# EAGLE board ArmazCape - Rev B4 (EAGLE 7.7.0)
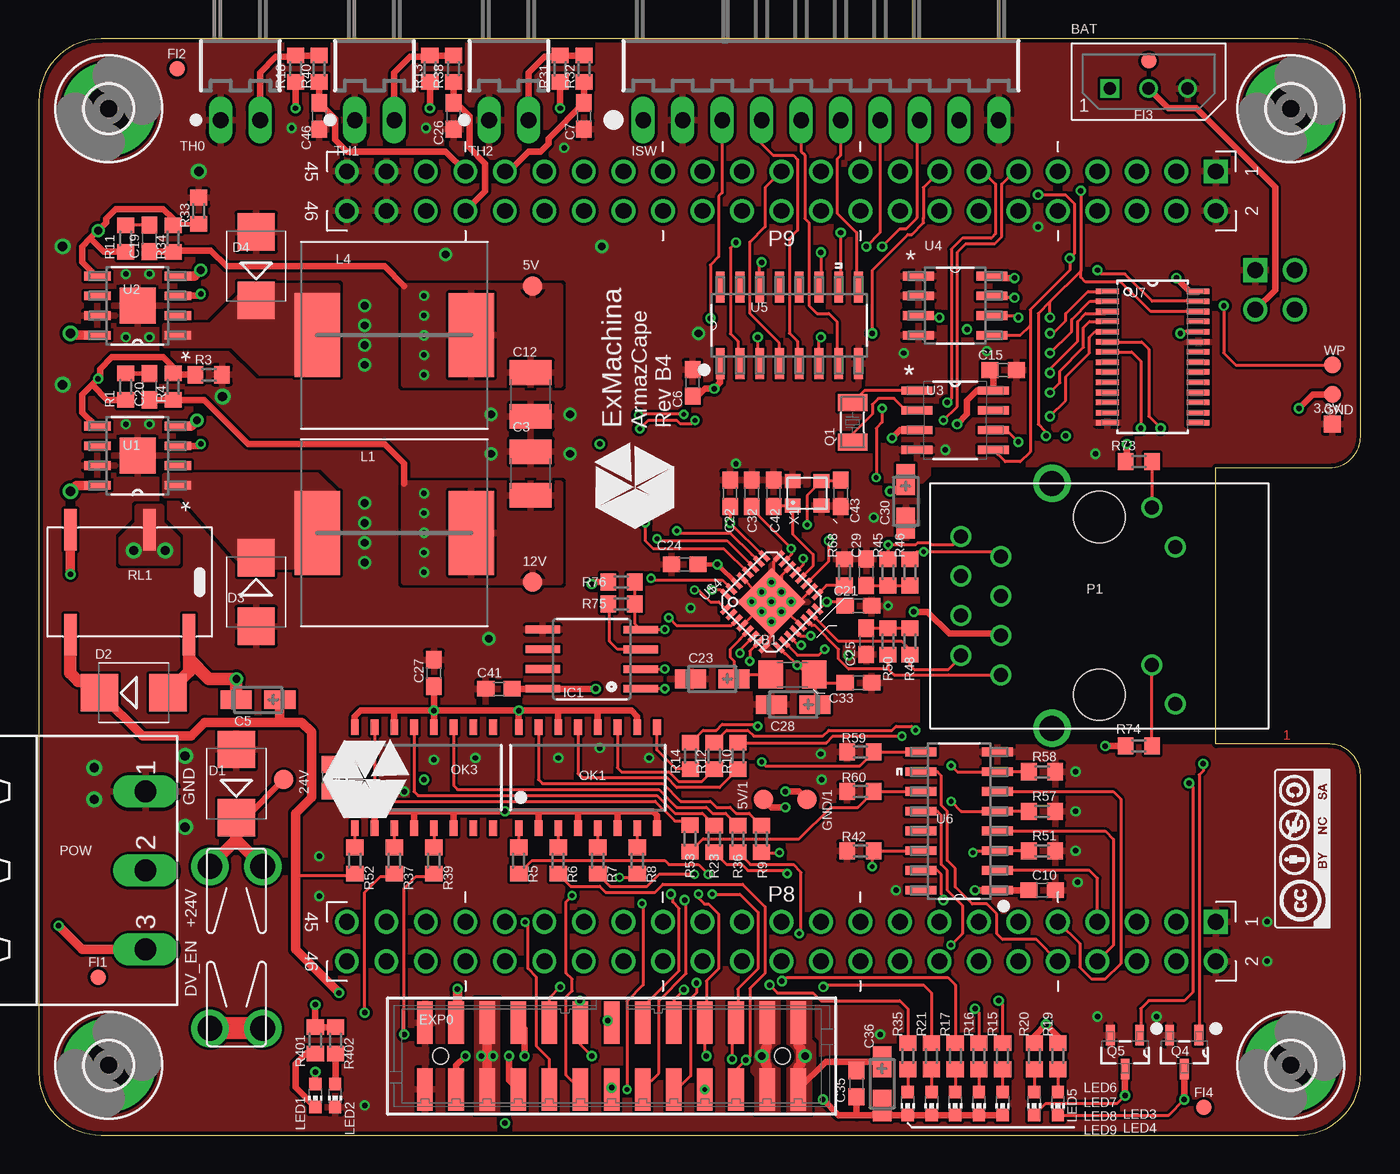
[diagram p4: board, top side]
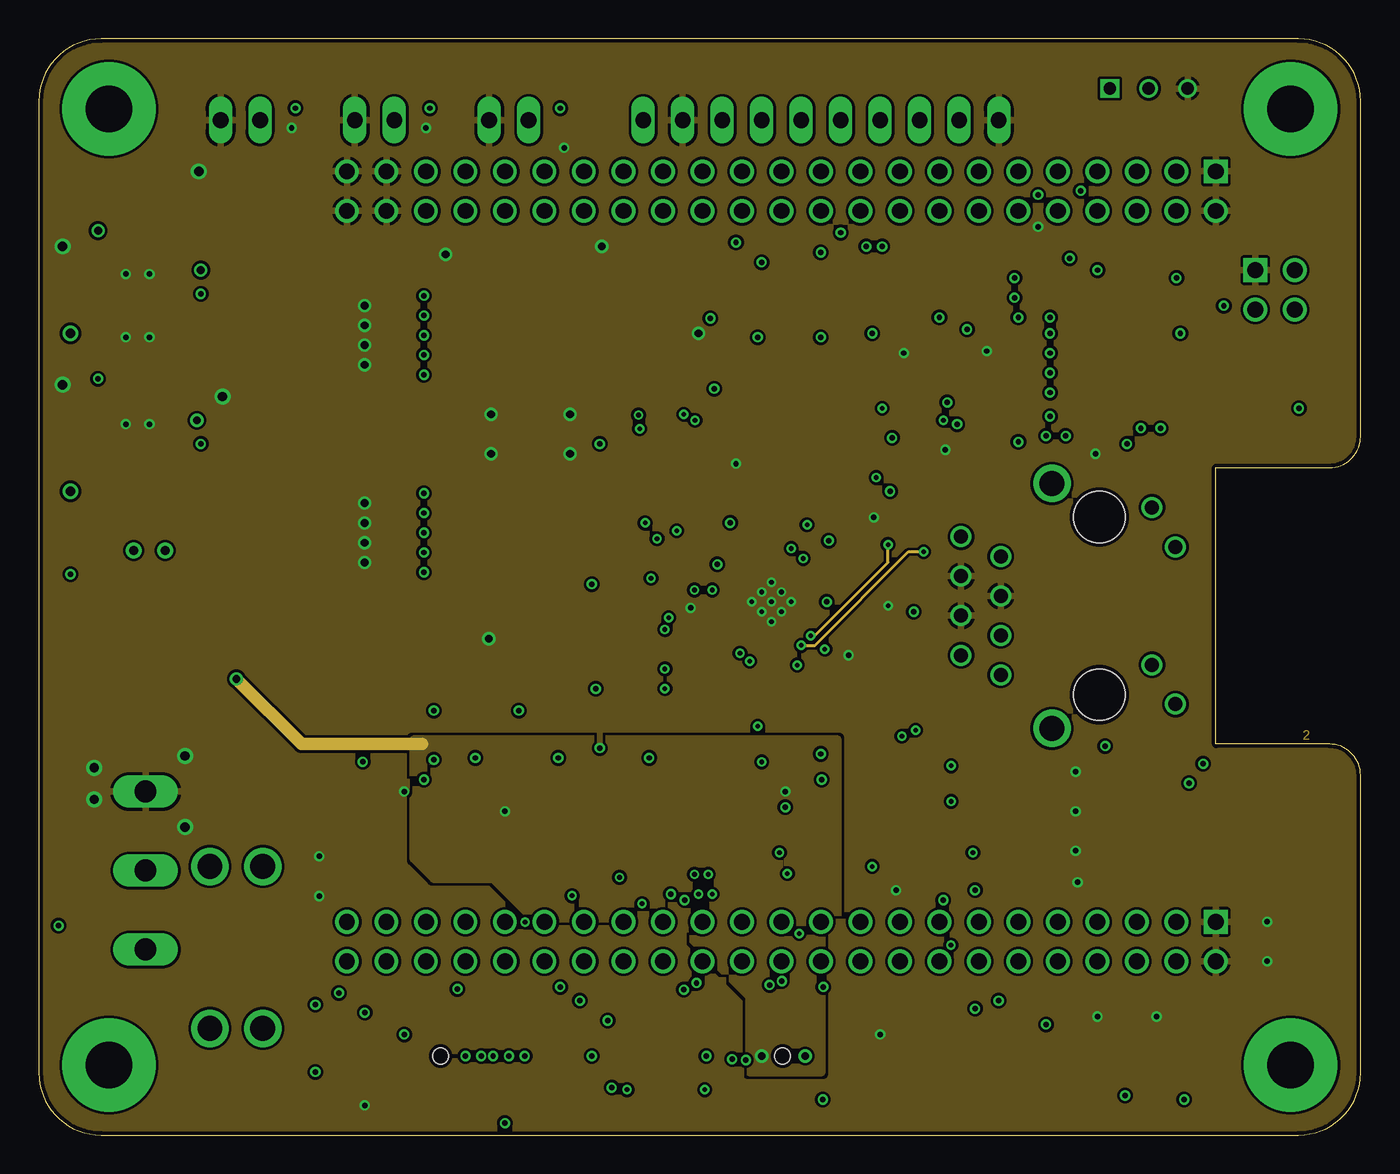
[diagram p5: board, inner layer Route2]
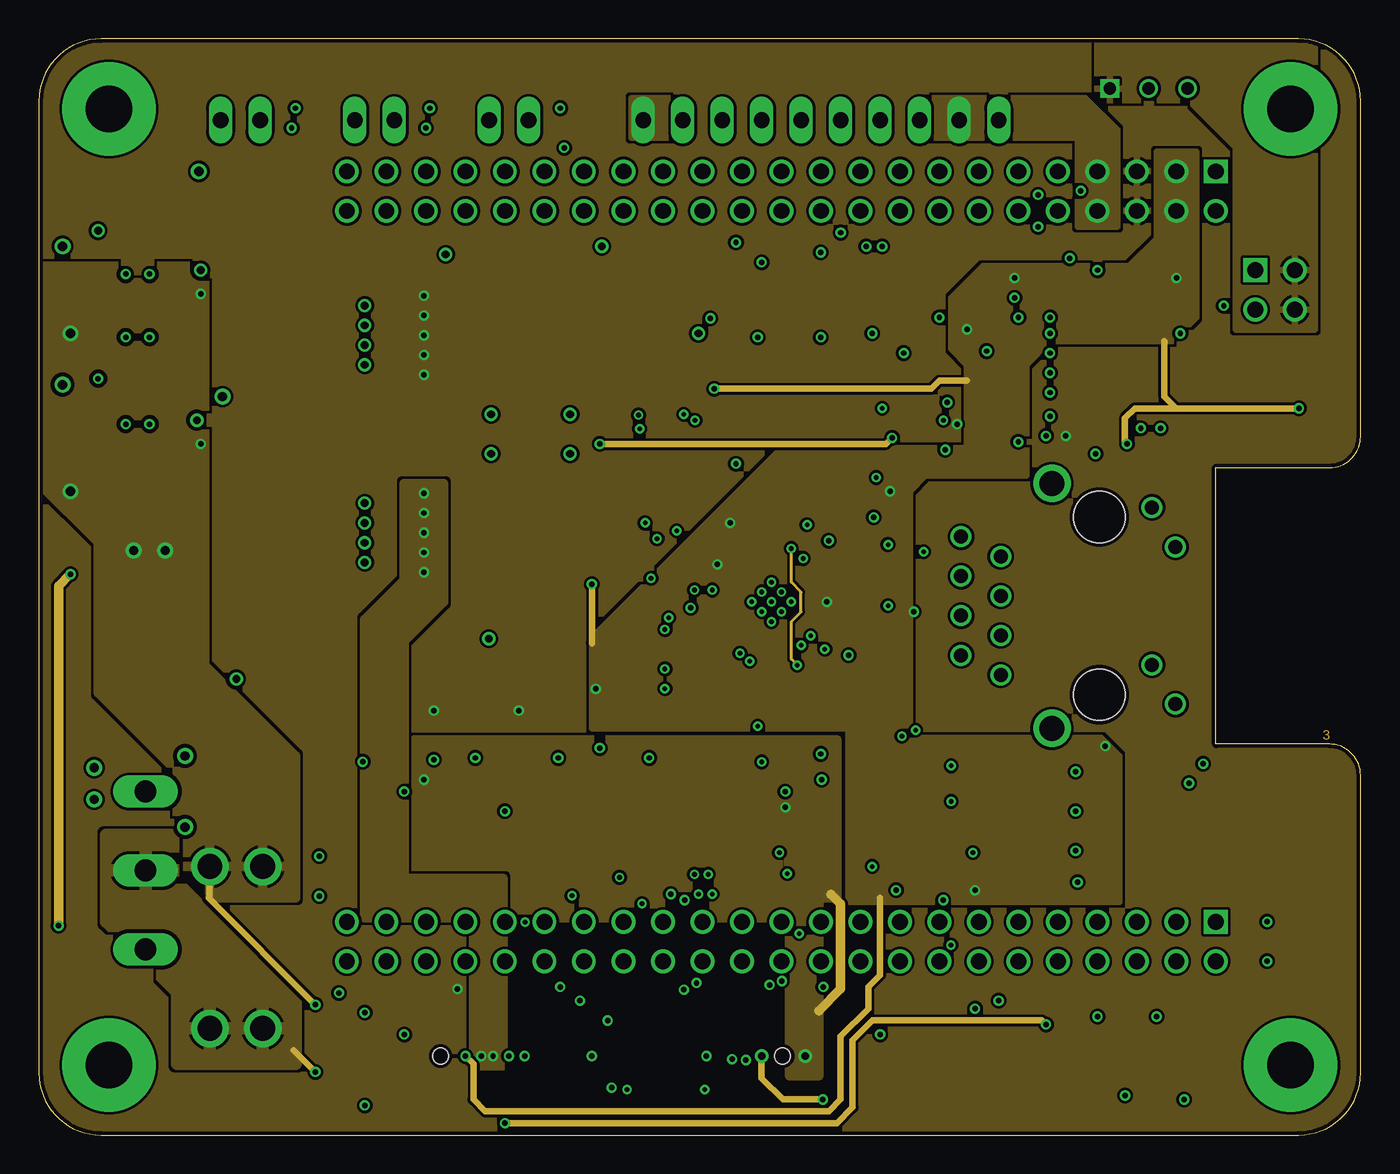
[diagram p6: board, inner layer Route15]
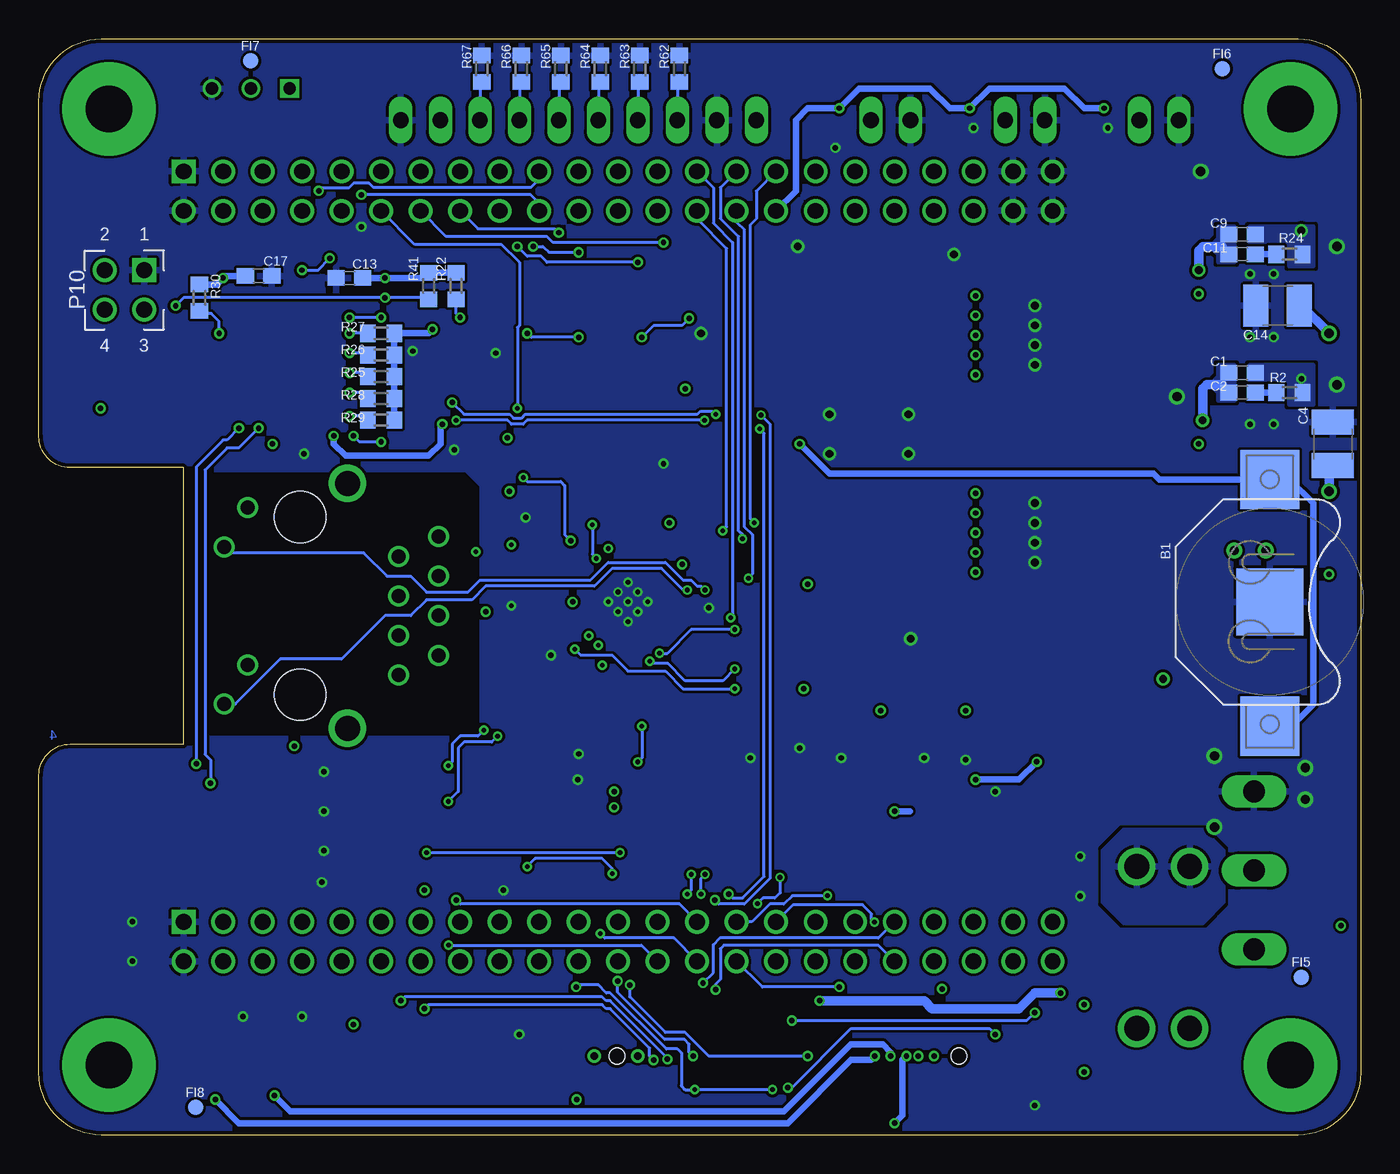
[diagram p7: board, bottom side, seen from below]

Size 85 x 70.5 mm. Coordinates in mm from the lower left corner, seen from the top.
Outline: 75.69,42.93 83,42.93 arc90 85,44.93 85,66.5 arc90 81,70.5 4,70.5 arc90 0,66.5 0,4 arc90 4,0 81,0 arc90 85,4 85,23.15 arc90 83,25.15 75.69,25.15 75.69,42.93
Copper layers (1+2*15+16): Top 0.018mm / dielectric 0.36mm / Route2 0.035mm / dielectric 0.71mm / Route15 0.035mm / dielectric 0.36mm / Bottom 0.018mm
Design rules "eC_4Layer_PClass5_BaseCopperO18-I35 *": minimum track width 0.175mm, minimum drill 0.3mm, track to track 0.175mm, track to pad 0.175mm, pad to pad 0.175mm, via to via 0.175mm, smd to smd 0mil, copper to edge 0.25mm, drill to drill 0.35mm, minimum pad ring 0.2mm, minimum via ring 0.15mm, stop-mask expansion 0mil, vias tented up to drill 0.45mm, thermal gap 0.2mm
Net classes: 0 default: width 0.178 mm, drill 0.25 mm, clearance 0.102 mm; 1 supply: width 0.406 mm, drill 0.35 mm, clearance 0.203 mm to class 0, clearance 0.02 mm

## Footprints (pad centres in the part's own frame; a part is rotated, then mirrored left to right if it is on the bottom)
TP11R = smd 1.1 x 1.1: TP 0,0
B1,27 = smd 1.27 x 1.27: TP 0,0
3000 = smd 3.81 x 3.81: +1 -7.874,0; +2 8.001,0 | smd 4.318 x 4.318: - 0,0
5267-03A = drill 0.8 square: P1 -2.5,0 | drill 0.8: P2 0,0; P3 2.5,0
BBB = drill 1.016 square: P8.1 -27.94,46.99; P9.1 -27.94,-1.27; P10.1 -30.48,5.08 | drill 1.016: P8.2 -27.94,49.53; P8.3 -25.4,46.99; P8.4 -25.4,49.53; P8.5 -22.86,46.99; P8.6 -22.86,49.53; P8.7 -20.32,46.99; P8.8 -20.32,49.53; P8.9 -17.78,46.99; P8.10 -17.78,49.53; P8.11 -15.24,46.99; P8.12 -15.24,49.53; P8.13 -12.7,46.99; P8.14 -12.7,49.53; P8.15 -10.16,46.99; P8.16 -10.16,49.53; P8.17 -7.62,46.99; P8.18 -7.62,49.53; P8.19 -5.08,46.99; P8.20 -5.08,49.53; P8.21 -2.54,46.99; P8.22 -2.54,49.53; P8.23 0,46.99; P8.24 0,49.53; P8.25 2.54,46.99; P8.26 2.54,49.53; P8.27 5.08,46.99; P8.28 5.08,49.53; P8.29 7.62,46.99; P8.30 7.62,49.53; P8.31 10.16,46.99; P8.32 10.16,49.53; P8.33 12.7,46.99; P8.34 12.7,49.53; P8.35 15.24,46.99; P8.36 15.24,49.53; P8.37 17.78,46.99; P8.38 17.78,49.53; P8.39 20.32,46.99; P8.40 20.32,49.53; P8.41 22.86,46.99; P8.42 22.86,49.53; P8.43 25.4,46.99; P8.44 25.4,49.53; P8.45 27.94,46.99; P8.46 27.94,49.53; P9.2 -27.94,1.27; P9.3 -25.4,-1.27; P9.4 -25.4,1.27; P9.5 -22.86,-1.27; P9.6 -22.86,1.27; P9.7 -20.32,-1.27; P9.8 -20.32,1.27; P9.9 -17.78,-1.27; P9.10 -17.78,1.27; P9.11 -15.24,-1.27; P9.12 -15.24,1.27; P9.13 -12.7,-1.27; P9.14 -12.7,1.27; P9.15 -10.16,-1.27; P9.16 -10.16,1.27; P9.17 -7.62,-1.27; P9.18 -7.62,1.27; P9.19 -5.08,-1.27; P9.20 -5.08,1.27; P9.21 -2.54,-1.27; P9.22 -2.54,1.27; P9.23 0,-1.27; P9.24 0,1.27; P9.25 2.54,-1.27; P9.26 2.54,1.27; P9.27 5.08,-1.27; P9.28 5.08,1.27; P9.29 7.62,-1.27; P9.30 7.62,1.27; P9.31 10.16,-1.27; P9.32 10.16,1.27; P9.33 12.7,-1.27; P9.34 12.7,1.27; P9.35 15.24,-1.27; P9.36 15.24,1.27; P9.37 17.78,-1.27; P9.38 17.78,1.27; P9.39 20.32,-1.27; P9.40 20.32,1.27; P9.41 22.86,-1.27; P9.42 22.86,1.27; P9.43 25.4,-1.27; P9.44 25.4,1.27; P9.45 27.94,-1.27; P9.46 27.94,1.27; P10.2 -33.02,5.08; P10.3 -30.48,7.62; P10.4 -33.02,7.62
C0603 = smd 1.1 x 1: 1 -0.85,0; 2 0.85,0
C1210 = smd 1.6 x 2.7: 1 -1.4,0; 2 1.4,0
CT3216 = smd 2 x 1.2: + -1.4,0; - 1.4,0
SMB = smd 2.4 x 2.4: A 2.2,0; C -2.2,0
87832-26 = smd 1 x 2.75: 1 -12,-2.15; 2 -12,2.15; 3 -10,-2.15; 4 -10,2.15; 5 -8,-2.15; 6 -8,2.15; 7 -6,-2.15; 8 -6,2.15; 9 -4,-2.15; 10 -4,2.15; 11 -2,-2.15; 12 -2,2.15; 13 0,-2.15; 14 0,2.15; 15 2,-2.15; 16 2,2.15; 17 4,-2.15; 18 4,2.15; 19 6,-2.15; 20 6,2.15; 21 8,-2.15; 22 8,2.15; 23 10,-2.15; 24 10,2.15; 25 12,-2.15; 26 12,2.15 | hole 1: -11,0; 11,0
1206 = smd 1.6 x 1.8: 1 -1.451,0.025; 2 1.349,0.025
FIDUCIAL-1X2 = smd 1 x 1: 1 0,0
3557-LITTLE = drill 1.6: 1 -5.207,-1.702; 2 -5.207,1.702; 3 5.207,-1.702; 4 5.207,1.702
TP11SQ = smd 1.1 x 1.1: TP 0,0
P3,0 = drill 3 pad 6: 1 0,0
SOIC8 = smd 0.5 x 2.2: 1 -1.905,-3.154; 2 -0.645,-3.154; 3 0.625,-3.154; 4 1.895,-3.154; 5 1.905,3.154; 6 0.635,3.154; 7 -0.635,3.154; 8 -1.905,3.154
7395-10 = drill 1.016 long: 1 11.43,0; 2 8.89,0; 3 6.35,0; 4 3.81,0; 5 1.27,0; 6 -1.27,0; 7 -3.81,0; 8 -6.35,0; 9 -8.89,0; 10 -11.43,0
WE-PD_1260/1245/1280/1210 = smd 2.9 x 5.4: 1 -4.95,0; 2 4.95,0
CHIP-LED0603 = smd 0.8 x 0.8: A 0,-0.75; C 0,0.75
MINI-FLAT-16 = smd 1 x 0.5: 1 -3.24,4.445; 2 -3.24,3.175; 3 -3.24,1.905; 4 -3.24,0.635; 5 -3.24,-0.635; 6 -3.24,-1.905; 7 -3.24,-3.175; 8 -3.24,-4.445; 9 3.24,-4.445; 10 3.24,-3.175; 11 3.24,-1.905; 12 3.24,-0.635; 13 3.24,0.635; 14 3.24,1.905; 15 3.24,3.175; 16 3.24,4.445
WIZNET_RB1-125BAG1A = drill 0.9: L1 6.325,-3.38; L2 3.784,-4.899; L3 -3.786,-3.379; L4 -6.325,-4.9 | drill 0.9 pad 1.3: R1 -4.446,6.349; R2 -3.176,8.889; R3 -1.906,6.349; R4 -0.636,8.889; R5 0.634,6.349; R6 1.904,8.889; R7 3.174,6.349; R8 4.444,8.889 | drill 1.6 pad 2.184: S1 -7.876,3.049; S2 7.874,3.049 | hole 3.3: 5.714,-0.001; -5.716,-0.001
MSTBA3 = drill 1.397 long: 1 -5.08,5.08; 2 0,5.08; 3 5.08,5.08
ABS07 = smd 1.092 x 1.905: 1 -1.27,0; 2 1.27,0
SOT95P240X112-3N = smd 1.321 x 0.559: 1 -1.092,0.94; 2 -1.092,-0.94; 3 1.092,0
R0603 = smd 1 x 1.1: 1 -0.85,0; 2 0.85,0
G6L-1F = smd 0.8 x 2.66: 2 -1.27,-3.37; 4 3.81,-3.37; 5 3.81,3.37; 8 -3.81,3.37
7395-02 = drill 1.016 long: 1 1.27,0; 2 -1.27,0
SOIC127P600X170-9N = smd 1.702 x 0.559: 1 -2.591,1.905; 2 -2.591,0.635; 3 -2.591,-0.635; 4 -2.591,-1.905; 5 2.591,-1.905; 6 2.591,-0.635; 7 2.591,0.635; 8 2.591,1.905 | smd 2.311 x 2.311: 9 0,0
MAXIM_SOIC127P600X175-8N = smd 1.981 x 0.533: 1 -2.464,1.905; 2 -2.464,0.635; 3 -2.464,-0.635; 4 -2.464,-1.905; 5 2.464,-1.905; 6 2.464,-0.635; 7 2.464,0.635; 8 2.464,1.905
MICROCHIP_BY_ELEMENT14_BATCH_1_SOIC127P600X175-8N = smd 1.981 x 0.559: 1 -2.362,1.905; 2 -2.362,0.635; 3 -2.362,-0.635; 4 -2.362,-1.905; 5 2.362,-1.905; 6 2.362,-0.635; 7 2.362,0.635; 8 2.362,1.905
SOIC127P600X175-16N = smd 1.981 x 0.559: 1 -2.464,4.445; 2 -2.464,3.175; 3 -2.464,1.905; 4 -2.464,0.635; 5 -2.464,-0.635; 6 -2.464,-1.905; 7 -2.464,-3.175; 8 -2.464,-4.445; 9 2.464,-4.445; 10 2.464,-3.175; 11 2.464,-1.905; 12 2.464,-0.635; 13 2.464,0.635; 14 2.464,1.905; 15 2.464,3.175; 16 2.464,4.445
SOP65P640X110-28N = smd 1.473 x 0.356: 1 -2.921,4.216; 2 -2.921,3.581; 3 -2.921,2.921; 4 -2.921,2.286; 5 -2.921,1.626; 6 -2.921,0.965; 7 -2.921,0.33; 8 -2.921,-0.33; 9 -2.921,-0.965; 10 -2.921,-1.626; 11 -2.921,-2.286; 12 -2.921,-2.921; 13 -2.921,-3.581; 14 -2.921,-4.216; 15 2.921,-4.216; 16 2.921,-3.581; 17 2.921,-2.921; 18 2.921,-2.286; 19 2.921,-1.626; 20 2.921,-0.965; 21 2.921,-0.33; 22 2.921,0.33; 23 2.921,0.965; 24 2.921,1.626; 25 2.921,2.286; 26 2.921,2.921; 27 2.921,3.581; 28 2.921,4.216
QFN50P500X500X85-32L = smd 0.8 x 0.3: 1 -2.41,1.75; 2 -2.41,1.25; 3 -2.41,0.75; 4 -2.41,0.25; 5 -2.41,-0.25; 6 -2.41,-0.75; 7 -2.41,-1.25; 8 -2.41,-1.75; 17 2.41,-1.75; 18 2.41,-1.25; 19 2.41,-0.75; 20 2.41,-0.25; 21 2.41,0.25; 22 2.41,0.75; 23 2.41,1.25; 24 2.41,1.75 | smd 0.3 x 0.8: 9 -1.75,-2.41; 10 -1.25,-2.41; 11 -0.75,-2.41; 12 -0.25,-2.41; 13 0.25,-2.41; 14 0.75,-2.41; 15 1.25,-2.41; 16 1.75,-2.41; 25 1.75,2.41; 26 1.25,2.41; 27 0.75,2.41; 28 0.25,2.41; 29 -0.25,2.41; 30 -0.75,2.41; 31 -1.25,2.41; 32 -1.75,2.41 | smd 3.1 x 3.1: BP 0,0
SMD2.5X2 = smd 1 x 0.9: 1 -0.925,-0.775; 2 0.925,-0.775; 3 0.925,0.775; 4 -0.925,0.775

## Placement (x,y rotation side)
3.3V  PTR1TP11R  [TP11R]  83.19,47.62 180 top
5V  TPB1,27  [B1,27]  31.75,54.61 0 top
5V/1  TPB1,27  [B1,27]  46.61,21.59 90 top
12V  TPB1,27  [B1,27]  31.75,35.56 0 top
24V  TPB1,27  [B1,27]  15.75,22.86 270 top
B1  3000  [3000]  5.84,34.29 270 bottom
BAT  22-03-50  [5267-03A]  71.37,67.31 0 top
BB1  BBB  [BBB]  47.75,60.71 180 top
C1  470pF  [C0603]  7.62,49.02 0 bottom
C2  22nF  [C0603]  7.62,47.75 0 bottom
C3  47uF, 16V  [C1210]  31.62,42.55 90 top
C4  4.7uF, 50V  [C1210]  1.78,44.45 90 bottom
C5  4.7uF  [CT3216]  14.1,27.99 180 top
C6  0.1uF  [C0603]  42.04,48.39 90 top
C7  4.7uF  [C0603]  35.05,65.53 270 top
C8  0.1uF  [C0603]  18.67,22.99 270 top
C9  330pF  [C0603]  7.62,57.91 0 bottom
C10  0.1uF  [C0603]  64.52,15.75 0 top
C11  22nF  [C0603]  7.62,56.64 0 bottom
C12  47uF, 16V  [C1210]  31.62,47.62 270 top
C13  0.1uF  [C0603]  65.02,55.12 180 bottom
C14  4.7uF, 50V  [C1210]  5.33,53.34 180 bottom
C15  0.1uF  [C0603]  62,49.2 0 top
C17  0.1uF  [C0603]  70.87,55.24 0 bottom
C19  5.6nF  [C0603]  7.11,57.66 90 top
C20  4.7nF  [C0603]  7.11,48.13 90 top
C21  0.1uF  [C0603]  52.7,34.04 0 top
C22  0.1uF  [C0603]  44.45,41.27 90 top
C23  4.7uF  [CT3216]  43.31,29.34 180 top
C24  0.1uF  [C0603]  41.53,36.7 180 top
C25  0.1uF  [C0603]  53.21,31.75 270 top
C26  4.7uF  [C0603]  26.67,65.53 270 top
C27  0.1uF  [C0603]  25.4,29.72 90 top
C28  4.7uF  [CT3216]  48.51,27.69 180 top
C29  0.1uF  [C0603]  53.21,36.2 90 top
C30  4.7uF  [CT3216]  55.75,40.77 270 top
C32  0.1uF  [C0603]  45.85,41.27 90 top
C33  0.1uF  [C0603]  52.7,29.08 0 top
C35  0.1uF  [C0603]  52.58,3.3 270 top
C36  4.7uF  [CT3216]  54.23,3.3 270 top
C41  0.1uF  [C0603]  29.59,28.7 180 top
C42  18pF  [C0603]  47.24,41.27 90 top
C43  18pF  [C0603]  51.56,41.27 270 top
C46  4.7uF  [C0603]  18.03,65.53 270 top
D1  STPS3L40UF  [SMB]  12.7,22.61 90 top
D2  STPS3L40UF  [SMB]  6.1,28.45 0 top
D3  STPS3L40UF  [SMB]  13.97,34.92 270 top
D4  STPS3L40UF  [SMB]  13.97,55.88 90 top
EXP0  87832-26  [87832-26]  36.83,5.08 180 top
FB1  HI1206N101R-10  [1206]  48.51,29.59 0 top
FI1  FIDUCIAL1X2  [FIDUCIAL-1X2]  3.81,10.16 0 top
FI2  FIDUCIAL1X2  [FIDUCIAL-1X2]  8.89,68.58 0 top
FI3  FIDUCIAL1X2  [FIDUCIAL-1X2]  71.37,69.09 0 top
FI4  FIDUCIAL1X2  [FIDUCIAL-1X2]  74.93,1.78 0 top
FI5  FIDUCIAL1X2  [FIDUCIAL-1X2]  3.81,10.16 0 bottom
FI6  FIDUCIAL1X2  [FIDUCIAL-1X2]  8.89,68.58 0 bottom
FI7  FIDUCIAL1X2  [FIDUCIAL-1X2]  71.37,69.09 0 bottom
FI8  FIDUCIAL1X2  [FIDUCIAL-1X2]  74.93,1.78 0 bottom
FU1  FUSE3557L  [3557-LITTLE]  12.7,12.06 90 top
GND  PTR1TP11SQ  [TP11SQ]  83.19,45.72 0 top
GND/1  TPB1,27  [B1,27]  49.4,21.59 270 top
H1  MOUNT-PAD3,0  [P3,0]  80.5,4.5 180 top
H2  MOUNT-PAD3,0  [P3,0]  4.5,4.5 180 top
H3  MOUNT-PAD3,0  [P3,0]  4.5,66 180 top
H4  MOUNT-PAD3,0  [P3,0]  80.5,66 180 top
IC1  AT93C46EN-SH-BSOIC8  [SOIC8]  35.56,30.61 90 top
ISW  22-05-7108-10  [7395-10]  50.29,65.28 180 top
L1  47uH  [WE-PD_1260/1245/1280/1210]  22.86,38.73 0 top
L4  33uH  [WE-PD_1260/1245/1280/1210]  22.86,51.44 0 top
LED1  red  [CHIP-LED0603]  17.78,2.54 180 top
LED2  blue  [CHIP-LED0603]  19.05,2.54 180 top
LED3  blue  [CHIP-LED0603]  61.98,2.03 180 top
LED4  blue  [CHIP-LED0603]  60.45,2.03 180 top
LED5  blue  [CHIP-LED0603]  65.53,2.03 180 top
LED6  blue  [CHIP-LED0603]  64.01,2.03 180 top
LED7  blue  [CHIP-LED0603]  58.93,2.03 180 top
LED8  blue  [CHIP-LED0603]  57.4,2.03 180 top
LED9  blue  [CHIP-LED0603]  55.88,2.03 180 top
OK1  TLP283-4  [MINI-FLAT-16]  35.31,22.99 90 top
OK3  TLP283-4  [MINI-FLAT-16]  24.77,22.99 90 top
P1  RB1-125BAG1A  [WIZNET_RB1-125BAG1A]  68.2,34.04 90 top
POW  MSTBA3  [MSTBA3]  1.78,17.02 270 top
Q1  32.768kHz, 12.5pF  [ABS07]  52.32,45.85 270 top
Q4  IRLML6344TRPBF  [SOT95P240X112-3N]  73.66,5.33 270 top
Q5  IRLML6344TRPBF  [SOT95P240X112-3N]  69.85,5.33 270 top
R1  200  [R0603]  5.59,48.13 270 top
R2  2K2  [R0603]  4.57,47.75 0 bottom
R3  270  [R0603]  10.92,48.9 180 top
R4  5K1  [R0603]  8.64,48.13 270 top
R5  100  [R0603]  30.86,17.65 270 top
R6  100  [R0603]  33.4,17.65 270 top
R7  100  [R0603]  35.94,17.65 270 top
R8  100  [R0603]  38.48,17.65 270 top
R9  1k  [R0603]  46.48,19.05 270 top
R10  1k  [R0603]  44.96,24.38 270 top
R11  160  [R0603]  5.59,57.66 270 top
R12  1k  [R0603]  43.43,24.38 270 top
R13  4K7  [R0603]  25.15,68.58 270 top
R14  1k  [R0603]  41.91,24.38 270 top
R15  1K5  [R0603]  61.98,5.08 90 top
R16  1K5  [R0603]  60.45,5.08 90 top
R17  1K5  [R0603]  58.93,5.08 90 top
R18  4K7  [R0603]  16.51,68.58 270 top
R19  4K7  [R0603]  65.53,5.08 90 top
R20  4K7  [R0603]  64.01,5.08 90 top
R21  1K5  [R0603]  57.4,5.08 90 top
R22  4K7  [R0603]  58.17,54.61 90 bottom
R23  1k  [R0603]  43.43,19.05 90 top
R24  3K6  [R0603]  4.57,56.64 0 bottom
R25  4K7  [R0603]  62.99,48.77 0 bottom
R26  4K7  [R0603]  62.99,50.16 0 bottom
R27  4K7  [R0603]  62.99,51.56 0 bottom
R28  4K7  [R0603]  62.99,47.37 0 bottom
R29  4K7  [R0603]  62.99,45.97 0 bottom
R30  4K7  [R0603]  74.68,53.85 90 bottom
R31  4K7  [R0603]  33.53,68.58 270 top
R32  10K  [R0603]  35.05,68.58 270 top
R33  698  [R0603]  10.29,59.44 270 top
R34  5K1  [R0603]  8.64,57.66 270 top
R35  1K5  [R0603]  55.88,5.08 90 top
R36  1k  [R0603]  44.96,19.05 90 top
R37  100  [R0603]  22.86,17.65 270 top
R38  10K  [R0603]  26.67,68.58 270 top
R39  100  [R0603]  25.4,17.65 270 top
R40  10K  [R0603]  18.03,68.58 270 top
R41  4K7  [R0603]  59.94,54.61 90 bottom
R42  3K3  [R0603]  52.83,18.29 180 top
R45  49.9  [R0603]  54.61,36.2 90 top
R46  49.9  [R0603]  56.01,36.2 90 top
R48  49.9  [R0603]  56.01,31.75 90 top
R50  49.9  [R0603]  54.61,31.75 90 top
R51  3K3  [R0603]  64.52,18.29 0 top
R52  100  [R0603]  20.32,17.65 270 top
R53  1k  [R0603]  41.88,19.08 90 top
R57  3K3  [R0603]  64.52,20.83 0 top
R58  3K3  [R0603]  64.52,23.37 0 top
R59  3K3  [R0603]  52.83,24.64 180 top
R60  3K3  [R0603]  52.83,22.1 180 top
R62  3K3  [R0603]  43.81,68.58 90 bottom
R63  3K3  [R0603]  46.35,68.58 90 bottom
R64  3K3  [R0603]  48.9,68.58 90 bottom
R65  3K3  [R0603]  51.44,68.58 90 bottom
R66  3K3  [R0603]  53.98,68.58 90 bottom
R67  3K3  [R0603]  56.52,68.58 90 bottom
R68  3k01  [R0603]  51.82,36.2 270 top
R73  220  [R0603]  70.74,43.31 180 top
R74  220  [R0603]  70.74,25.02 180 top
R75  0  [R0603]  37.47,34.16 0 top
R76  4K7  [R0603]  37.47,35.56 0 top
R401  4K7  [R0603]  17.78,6.1 270 top
R402  4K7  [R0603]  19.08,6.1 90 top
RL1  G6L5VDC  [G6L-1F]  5.84,35.56 180 top
TH0  22-05-7028-02  [7395-02]  12.95,65.28 180 top
TH1  22-05-7028-02  [7395-02]  21.59,65.28 180 top
TH2  22-05-7028-02  [7395-02]  30.23,65.28 180 top
U1  L7985A  [SOIC127P600X170-9N]  6.35,43.69 180 top
U2  L7985A  [SOIC127P600X170-9N]  6.35,53.34 180 top
U3  DS1307ZN+  [MAXIM_SOIC127P600X175-8N]  58.93,45.97 0 top
U4  24AA256-I/SN  [MICROCHIP_BY_ELEMENT14_BATCH_1_SOIC127P600X175-8N]  58.93,53.34 0 top
U5  CD4050BD  [SOIC127P600X175-16N]  48.26,52.07 90 top
U6  CD4050BD  [SOIC127P600X175-16N]  59.18,20.19 180 top
U7  PCA9685PW  [SOP65P640X110-28N]  71.63,50.04 0 top
U$1  EXMACHINA-LOGO-NAME  [EXM-LOGO-BASELINE]  38.35,41.66 90 top
U$3  [A4L-LOC]  -83.19,-55.88 0 top  (outside the outline)
U$4  KSZ8851SNLI  [QFN50P500X500X85-32L]  47.12,34.29 45 top
U$5  [EXM-LOGO-BIG]  20.95,22.86 0 top
U$7  CC-BY-NC-SA  [CC-BY-NC-SA]  81.28,18.41 90 top
WP  PTR1TP11R  [TP11R]  83.19,49.53 0 top
X1  8Z-25.000MAAJ-T  [SMD2.5X2]  49.4,41.27 0 top

## Tracks (layer width: path | path; a pad name or v marks a point on that pad's centre or on a via)
!KSZ8851_INT  (via drill 0.3)
  Top 0.178: U$4.3 44.53,32.77 41.02,32.77 v40.51,33.27
  Bottom 0.178: BB1.P9.27 41.63,60.94 41.63,58.65 40.39,57.4 40.39,33.4 v40.51,33.27
!KSZ8851_RST  (via drill 0.3, 0.35)
  Top 0.178: U$4.19 50.8,36.91 v50.8,38.23 | v54.23,46.74 54.23,45.85 53.85,45.47 v53.85,42.29
  Bottom 0.178: BB1.P9.12 60.83,57.28 55.24,57.28 54.1,56.13 54.1,52.07 54.23,51.94 v54.23,46.74 | v53.85,42.29 53.59,42.04 51.44,42.04 51.18,41.78 51.18,38.61 v50.8,38.23
+3V3  (via drill 0.35)
  Top 0.178: C22.1 v44.45,39.37 46.59,37.23 U$4.25 | U$4.16 50.21,33.82 v50.67,34.29 51.6,34.29 C21.1
  Top 0.305: C24.1 v43.64,36.7 U$4.30
  Top 0.406: EXP0.24 26.83,4.48 v27.43,5.08 | U4.8 61.42,55.12 v62.74,55.12 | U5.1 43.81,48.39 v43.43,48.01 42.85,48.01 42.43,47.59 42.09,47.59 C6.1 | 3.3V.TP 81.92,47.62 v81.03,46.74 | U7.28 74.02,54.25 v73.15,55.12 | C10.1 U6.1 v60.2,15.75 | P1.R3 61.72,32.26 58.55,32.26 57.15,33.66 v56.26,33.66 | R74.2 v68.58,25.02 | v69.98,44.45 69.98,43.4 R73.2 | C30.+ 54.99,41.4 v54.74,41.4 | v35.81,28.7 IC1.8 C41.1 | v35.56,35.43 35.69,35.56 R76.1
  Route15 0.406: v27.43,5.08 27.94,4.57 27.94,2.29 28.7,1.52 50.8,1.52 51.56,2.29 51.56,6.35 53.34,8.13 53.34,9.53 54.1,10.29 54.1,15.24 | v43.43,48.01 57.4,48.01 57.91,48.51 59.69,48.51 | v81.03,46.74 73.15,46.74 | 73.15,46.74 72.39,47.5 72.39,51.05 | 73.15,46.74 70.48,46.74 69.85,46.1 69.85,44.58 v69.98,44.45 | v35.56,35.43 35.56,31.62
  Bottom 0.406: C13.1 v62.74,55.12 60.29,55.12 R41.2 R22.2 | C17.1 73.03,55.24 v73.15,55.12 73.57,54.7 R30.2 | R29.2 R28.2 R25.2 R26.2 R27.2 59.94,51.56 v59.69,51.82
  pour Route15 (no thermals): 74.42,63.25 71.88,63.25 71.88,57.66 70.1,55.88 60.71,55.88 58.67,53.85 58.67,50.55 59.69,49.53 59.69,44.2 47.75,44.2 35.56,32 35.56,26.16 52.07,26.16 52.07,14.99 69.47,14.99 69.47,24.38 68.33,25.53 57.02,25.53 56.01,26.54 56.01,41.4 57.02,42.42 63.5,42.42 63.5,49.53 65.02,51.05 72.9,51.05 74.42,52.58
+5V  (via drill 0.35)
  Top 0.406: 23.5,54.61 22.23,55.88 12.06,55.88 11.05,56.9 8.64,56.9 R34.2 C19.1 | v59.05,45.72 59.69,46.35 59.69,47.24 60.33,47.88 U3.8 61.39,48.83 61.15,49.07 C15.1 | OK3.16 20.32,26.92 20.7,27.3 22.99,27.3 | 22.99,27.3 v25.4,27.3 | v25.4,27.3 v30.86,27.3 | v30.86,27.3 33.4,27.3 | 33.4,27.3 35.94,27.3 | 35.94,27.3 38.1,27.3 38.48,26.92 OK1.10 | OK3.14 22.86,27.18 22.99,27.3 | OK3.12 v25.4,27.3 | OK1.16 v30.86,27.3 | OK1.14 33.4,27.3 | OK1.12 35.94,27.3 | C27.1 v25.4,27.3
  Top 0.61: EXP0.23 26.92,7.32 v26.92,9.4
  Bottom 0.406: v59.05,45.72 59.18,45.59 59.18,44.45 59.94,43.69 65.28,43.69 66.04,44.45 v66.04,44.96
  other vias: 24.77,50.16 24.77,52.7 24.77,51.44 24.77,53.98 24.77,48.9
  pour Top: 23.5,54.61 33.53,54.61 33.53,48.26 23.5,48.26
  pour Route15 (rank 5): -1.91,72.39 87,72.39 87,-1.91 -2.54,-2.54
+5V/1  (via drill 0.35, 0.5)
  Top 0.406: C36.+ 52.65,4.7 | 52.65,4.7 50.6,4.7 EXP0.2 | C35.1 52.58,4.63 52.65,4.7 | 5V/1.TP 47.12,21.08 v48.01,21.08 | C8.1 18.84,24 v20.83,24
  Top 0.61: EXP0.2 48.83,4.38 49.02,4.57 49.02,5.59 48.83,5.78 EXP0.1
  Route15 0.61: 50.16,8 51.56,9.4 51.56,14.86 50.93,15.49
  Bottom 0.406: v20.83,24 21.97,22.86 v24.77,22.86
  other vias: 49.28,5.08
  pour Route15 (isolate 0.127, rank 2, no thermals): 24.13,25.4 24.13,16.51 29.84,16.51 29.84,13.97 48.26,13.97 48.26,3.81 50.16,3.81 50.16,15.24 51.31,15.24 51.31,25.4
  pour Top (no thermals): 48.26,8.64 48.26,1.52 49.53,1.52 49.53,4.06 49.78,4.32 49.78,5.84 49.53,6.1 49.53,8.64
+12V  (via drill 0.35)
  Top 0.406: R20.2 64.01,6.35 v64.77,7.11 65.53,6.35 R19.2 | 23.5,41.91 23.5,43.18 22.23,44.45 13.46,44.45 10.63,47.28 R4.2 C20.1
  Top 0.61: EXP0.21 EXP0.22
  Route15 0.406: v29.97,0.76 51.31,0.76 52.32,1.78 52.32,6.1 53.59,7.37 64.52,7.37 v64.77,7.11
  Bottom 0.406: v29.97,0.76 29.46,1.27 29.46,4.83 v29.21,5.08
  other vias: 24.77,38.73 24.77,41.27 24.77,40.01 24.77,37.47 28.45,5.08 24.77,36.2
  pour Top: 23.5,41.91 33.53,41.91 33.53,35.56 23.5,35.56
  pour Route15 (no thermals): 23.5,41.91 23.5,35.69 20.95,33.15 20.95,13.97 27.94,13.97 27.94,4.45 29.84,4.45 29.84,16.51 23.5,16.51 23.5,31.75 26.04,34.29 26.04,41.91
  pour Top (no thermals): 28.19,1.52 29.46,1.52 29.46,8.64 28.19,8.64
BAT_TEMP
  Top 0.406: BB1.P10.3 79.5,54.36 79.5,60.96 74.42,66.04 72.64,66.04 BAT.P2
DRVEN_OUT  (via drill 0.35)
  Top 0.61: POW.3 2.79,11.94 v1.27,13.46 | v2.03,36.07 RL1.4
  Route15 0.61: v1.27,13.46 1.27,35.31 v2.03,36.07
DV0  (via drill 0.35)
  Top 0.178: 34.8,8.38 34.8,7.26 EXP0.15 34.83,5.81 v35.56,5.08 | v46.99,9.65 47.5,9.14 49.78,9.14 50.29,8.64 55.37,8.64 55.88,8.13 R35.2 | R52.2 20.18,16.66 16.51,16.66
  Top 0.61: 34.8,8.38 v34.8,8.64 | v19.3,9.14 16.51,11.94 16.51,16.66 16.51,20.7 17.53,21.72 17.53,25.93 16.91,26.54 15.62,26.54 | D2.C 6.69,25.65 9.78,25.65 10.67,26.54 15.62,26.54 | C5.+ 15.5,26.67 15.62,26.54
  Top 0.813: RL1.5 2.03,29.72 2.54,29.21 3.13,29.21 D2.C
  Bottom 0.178: v35.56,5.08 41.91,5.08 43.43,6.6 44.7,6.6 46.99,8.89 v46.99,9.65
  Bottom 0.61: v34.8,8.64 28.07,8.64 27.56,8.13 21.97,8.13 20.95,9.14 v19.3,9.14
EDDIO  (via drill 0.3)
  Top 0.178: U$4.6 45.09,31.2 v45.09,30.99 | R76.2 R75.2 38.31,32.9 IC1.4 v40.25,32.5 v40.26,32.51
  Bottom 0.178: v45.09,30.99 44.58,30.99 43.05,32.51 v40.26,32.51
EECS  (via drill 0.3)
  Top 0.178: U$4.10 48.78,30.86 50.16,30.86 v50.55,31.24 | v40.26,28.7 IC1.1
  Bottom 0.178: v50.55,31.24 50.16,30.86 48.13,30.86 47.12,29.84 44.7,29.84 43.56,28.7 v40.26,28.7
EESK  (via drill 0.3)
  Top 0.178: U$4.7 45.72,31.12 v45.72,30.48 | IC1.2 38.72,29.97 v40.26,29.97
  Bottom 0.178: v45.72,30.48 45.59,30.35 44.58,30.35 43.43,29.21 41.02,29.21 v40.26,29.97
ESW0  (via drill 0.3, 0.35)
  Top 0.178: v44.58,4.88 44.58,6.98 EXP0.5 44.96,7.36 44.96,9.4 46.25,10.69 46.25,14.33 45.09,15.49 v43.31,15.49 | v61.72,8.64 61.98,8.38 R15.2 | R5.2 31.71,17.65 40.26,17.65 40.51,17.4 42.42,17.4 v43.05,16.76
  Bottom 0.178: v44.58,4.88 44.58,4.95 48.26,8.64 48.51,8.64 48.77,8.89 61.47,8.89 v61.72,8.64 | v43.05,16.76 43.05,15.75 v43.31,15.49
ESW1  (via drill 0.35)
  Top 0.178: EXP0.6 44.83,4.19 v45.47,4.83 45.72,5.08 45.72,9.42 46.71,10.41 46.71,14.68 45.26,16.13 40.13,16.13 39.62,15.62 36.45,15.62 36.07,16 34.2,16 R6.2 | v60.2,8.13 60.45,7.87 R16.2
  Bottom 0.178: v45.47,4.83 45.72,5.08 45.72,5.59 48.26,8.13 48.51,8.13 48.77,8.38 59.94,8.38 v60.2,8.13
ESW2  (via drill 0.3, 0.35)
  Top 0.178: v42.93,5.08 42.83,5.18 EXP0.7 42.93,7.33 42.93,9.91 43.71,10.69 43.71,14.22 43.08,14.86 42.8,14.86 42.42,15.24 v42.42,15.49 | v47.78,9.91 47.85,9.91 48.08,10.13 58.45,10.13 58.93,9.65 R17.2 | R7.2 36.74,16 39.12,16 39.88,16.76 v42.16,16.76
  Bottom 0.178: v42.93,5.08 43.18,5.33 43.18,5.84 43.48,6.15 44.76,6.15 47.78,9.17 v47.78,9.91 | v42.42,15.49 42.42,16.51 v42.16,16.76
ESW3  (via drill 0.3, 0.35)
  Top 0.178: v50.44,9.53 50.57,9.65 56.9,9.65 57.4,9.14 R21.2 | v38.79,14.88 38.86,14.81 38.86,9.65 37.82,8.61 v37.82,2.92 | v37.34,16.57 38.25,16.57 R8.2 | EXP0.8 v42.82,2.92
  Bottom 0.178: v50.44,9.53 50.32,9.65 49.02,9.65 48.51,9.14 48.26,9.14 44.65,5.54 43.94,5.54 43.69,5.28 43.69,3.17 43.43,2.92 v42.82,2.92 | v37.34,16.57 37.34,15.57 37.67,15.24 38.43,15.24 v38.79,14.88 | v37.82,2.92 v42.82,2.92 | v42.82,2.92
ESW5  (via drill 0.35)
  Top 0.178: EXP0.13 36.69,7.37 v36.58,7.37 | v20.95,7.87 20.95,15.62 21.97,16.64 22.69,16.64 R37.2
  Bottom 0.178: v36.58,7.37 21.46,7.37 v20.95,7.87
ESW6  (via drill 0.35)
  Top 0.178: EXP0.14 v36.83,3.05 | v23.5,6.48 23.5,15.88 24.26,16.64 25.23,16.64 R39.2
  Bottom 0.178: v36.83,3.05 36.58,3.05 32.77,6.86 23.88,6.86 v23.5,6.48
FAN0  (via drill 0.35)
  Top 0.178: U7.6 70.92,51 71.37,50.55 71.37,46.23 v72.14,45.47 | v74.88,23.88 74.88,23.42 74.62,23.16 74.62,6.45 Q4.1
  Bottom 0.178: v72.14,45.47 72.9,44.7 73.15,44.7 74.88,42.98 v74.88,23.88
FAN0_GND  (via drill 0.35)
  Top 0.178: LED5.C 72.66,1.28 v73.66,2.29
  Top 0.406: v73.66,2.29 Q4.3 | EXP0.19 31.24,6.82 v31.24,5.08
  Bottom 0.406: v31.24,5.08 31.5,4.83 32.77,4.83 36.83,0.76 72.14,0.76 v73.66,2.29
FAN1  (via drill 0.35)
  Top 0.178: U7.7 70.28,50.37 70.87,49.78 v70.87,45.47 | v73.97,22.63 74.22,22.38 74.22,9.2 73.66,8.64 71.37,8.64 70.87,8.13 70.87,6.5 Q5.1
  Bottom 0.178: v70.87,45.47 72.14,44.2 72.9,44.2 74.32,42.77 74.32,24.49 73.97,24.13 v73.97,22.63
FAN1_GND  (via drill 0.35)
  Top 0.178: LED6.C 64.76,2.03 69.34,2.03 v69.85,2.54
  Top 0.406: EXP0.20 30.23,3.53 v30.23,5.08 | v69.85,2.54 Q5.3
  Bottom 0.406: v30.23,5.08 30.23,5.33 30.73,5.84 32.77,5.84 37.08,1.52 68.83,1.52 v69.85,2.54
GND  (via drill 0.3, 0.35, 0.5, 0.6)
  Top 0.178: U$4.29 46.13,34.92 v46.48,34.92 | U$4.4 46.13,33.66 v46.48,33.66 | U$4.22 47.75,35.99 v47.75,34.92 | U$4.24 47.24,36.89 47.24,35.69 v47.12,35.56 | U$4.13 48.11,33.66 v47.75,33.66 | U$4.18 48.88,34.29 v48.39,34.29 | U$4.8 46.94,31.64 46.94,31.95 47.12,32.13 v47.12,33.02
  Top 0.406: v46.48,34.92 U$4.BP | U$4.BP v47.75,33.66 | U$4.BP v45.85,34.29 v46.48,33.66 | v47.12,35.56 v47.75,34.92
  other vias: 5.59,55.37 7.11,55.37 5.59,51.31 7.11,51.31 20.95,1.91 3.56,21.59 3.56,23.62 9.4,24.38 9.4,19.81 20.95,53.34 20.95,52.07 20.95,50.8 20.95,49.53 1.52,57.15 5.59,45.72 7.11,45.72 1.52,48.26 36.2,57.15 26.16,56.64 20.95,40.64 20.95,39.37 20.95,38.1 20.95,36.83 24.89,64.77 16.26,64.77 33.78,63.5 78.99,13.72 78.99,11.18 68.07,7.62 71.88,7.62 60.96,50.42 55.63,50.29 54.1,6.48 18.03,17.93 29.08,46.35 29.08,43.81 34.16,43.81 42.42,51.56 28.93,31.93 44.83,43.18 36.07,24.89 55.12,15.75 58.29,44.07 64.26,58.42 53.7,39.73 66.67,20.83 34.16,46.35 66.8,16.26 66.67,23.37 10.29,61.98 11.81,47.5 47.12,34.29 67.94,43.81 66.67,18.29 52.07,30.86 54.61,34.04 41.91,33.91 50.29,24.51 25.4,24.13 28.07,24.26 33.4,24.26 39.24,24.26 23.5,22.1 50.34,22.86 18.03,15.37
  pour Bottom (rank 6): -3.27,-3.27 87.63,-2.54 87.63,73.03 -2.54,73.03
  pour Top (rank 6): -1.36,-1.36 85.72,-0.64 85.72,71.12 -0.64,71.12
  pour Route2 (rank 6): -2,-2 86.36,-1.27 86.36,71.75 -1.27,71.75
  cutout Top: 56.9,41.66 56.9,26.54 57.53,25.91 78.23,25.91 78.23,42.42 57.66,42.42
  cutout Bottom: 56.9,41.66 56.9,26.54 57.53,25.91 78.23,25.91 78.23,42.42 57.66,42.42
GND1  (via drill 0.35, 0.5)
  Top 0.406: LED3.C LED4.C LED7.C LED8.C LED9.C 54.85,1.28 C36.- 53.6,1.27 52.58,1.27 | OK3.2 21.59,20.45 | 21.59,20.45 21.97,20.83 24.13,20.83 | 24.13,20.83 26.54,20.83 | 26.54,20.83 v29.97,20.83 32,20.83 | 32,20.83 34.8,20.83 | 34.8,20.83 37.08,20.83 | 37.08,20.83 39.5,20.83 39.75,20.57 OK1.8 | OK3.4 24.13,20.83 | OK3.6 26.67,20.7 26.54,20.83 | OK1.2 32.13,20.7 32,20.83 | OK1.4 34.67,20.7 34.8,20.83 | OK1.6 37.21,20.7 37.08,20.83 | 52.58,1.27 51.44,1.27 v50.42,2.29 | 52.58,1.27 C35.2 | GND/1.TP 48.9,22.1 v48.01,22.1 | 21.59,20.45 21.59,21.08 20.54,22.14 C8.2
  Top 0.61: EXP0.4 46.83,4.48 46.74,4.57 46.74,5.59 46.83,5.68 EXP0.3
  Top 0.813: 9.65,30.61 9.65,29.8 D2.A | RL1.8 9.65,30.61 | 9.65,30.61 10.92,29.34 v12.7,29.34 v12.7,29.33 C5.-
  Route2 0.813: v12.7,29.34 16.89,25.15 24.64,25.15
  Route15 0.406: v50.42,2.29 47.85,2.29 46.48,3.65 v46.48,5.08
  Bottom 0.406: 29,20.83 v29.97,20.83
  pour Route2 (no thermals): 24.13,25.4 24.13,17.78 25.4,16.51 29.21,16.51 31.75,13.97 40.64,13.97 45.72,8.89 45.72,4.06 50.29,4.06 50.29,12.95 51.31,13.97 51.31,25.4
  pour Top (no thermals): 46.23,8.64 46.23,6.35 45.72,5.84 45.72,4.32 46.23,3.81 46.23,1.52 47.5,1.52 47.5,8.64
I2C2_SCL  (via drill 0.35)
  Top 0.178: v67,60.73 67,55.58 | 67,55.58 65.02,53.59 | 65.02,53.59 64.26,52.83 64.26,45.72 64.77,45.21 | 61.85,45.34 U3.6 62.23,45.34 v62.99,44.58 | U4.6 62.87,52.7 v62.99,52.58 | v65.02,52.58 65.02,53.59 | U7.26 71.5,52.96 69.6,54.86 67.31,54.86 67,55.17 67,55.58
  Top 0.2: v64.77,44.96 64.77,45.21
  Bottom 0.178: BB1.P9.19 52.83,61.47 53.37,60.94 63.48,60.94 63.75,61.21 64.77,61.21 65.08,60.91 66.83,60.91 v67,60.73 | 64.52,44.7 v64.77,44.96 64.39,44.58 v62.99,44.58 | v62.99,52.58 v65.02,52.58
I2C2_SDA  (via drill 0.35)
  Top 0.178: v64.26,60.48 66.02,60.48 66.6,59.89 66.6,56.69 v66.29,56.39 66.29,55.63 63.75,53.09 63.75,52.07 | 63.75,52.07 63.75,43.94 63.12,43.31 62.15,43.31 U3.5 | U4.5 63.12,51.44 63.75,52.07 | U7.27 71.6,53.62 69.85,55.37 68.33,55.37 v68.07,55.63
  Bottom 0.178: BB1.P9.20 52.83,59.94 53.37,60.48 v64.26,60.48 | v68.07,55.63 67.06,55.63 v66.29,56.39
LED0  (via drill 0.3)
  Top 0.178: v42.16,35.05 42.42,35.05 43.18,34.29 43.71,34.29 U$4.1
  Bottom 0.178: v42.16,35.05 42.42,35.31 42.67,35.31 43.05,35.69 43.56,35.69 44.7,36.83 48.39,36.83 49.53,35.69 56.64,35.69 57.4,34.92 60.07,34.92 61.09,35.94 62.61,35.94 64.11,37.44 72.72,37.44 P1.L2
LED1  (via drill 0.3)
  Top 0.178: U$4.32 43.88,35.05 v43.31,35.05
  Bottom 0.178: v43.31,35.05 43.56,35.05 44.96,36.45 48.13,36.45 49.28,35.31 56.26,35.31 57.15,34.42 60.07,34.42 61.09,33.4 62.74,33.4 65.53,30.61 69.47,30.61 72.36,27.71 P1.L4
N$1  (via drill 0.35)
  Top 0.406: U1.5 3.68,45.59 2.79,46.48 2.79,47.62 3.43,48.26 | 3.43,48.26 v3.81,48.64 3.94,48.77 3.94,49.28 4.7,50.04 8,50.04 8.64,49.4 R4.1 8.72,48.9 R3.2 | R1.2 4.41,47.28 3.43,48.26
  Bottom 0.406: 6.73,49.02 C1.2
  pour Bottom (no thermals): 4.57,46.99 3.05,46.99 3.05,49.53 7.11,49.53 7.11,48.51 4.57,48.51
N$2
  Bottom 0.406: R2.1 C2.2
N$3  (via drill 0.5)
  Top 0.61: U1.4 9.78,45.59 v10.16,45.97
  Bottom 0.61: 8.89,48.17 8.89,48.26 9.91,48.26 10.16,48.01 v10.16,45.97
  pour Bottom (no thermals): 8.13,49.53 8.13,47.24 9.14,47.24 9.14,47.75 9.4,48.01 9.4,48.51 9.14,48.77 9.14,49.53
N$4
  Top 0.178: OK3.11 26.67,22.48 26.92,22.23 39.88,22.23 41.02,21.08 42.93,21.08 43.31,20.7 44.16,20.7 R36.2
N$5
  Top 0.178: OK3.13 24.13,22.1 24.38,21.84 39.75,21.84 40.89,20.7 42.67,20.7 43.43,19.94 R23.2
N$6
  Top 0.178: OK3.3 R37.1
N$7
  Top 0.178: R35.1 LED9.A
N$8
  Top 0.406: LED1.C 16.51,3.06 16.51,4.57 17.18,5.25 R401.2
N$9
  Top 0.178: R19.1 LED5.A
N$10
  Top 0.178: OK1.1 R5.1
N$11
  Top 0.178: OK1.15 32.13,22.86 32.38,22.61 40.13,22.61 41.27,21.46 43.18,21.46 43.56,21.08 44.45,21.08 44.83,20.7 45.68,20.7 R9.1
N$12
  Top 0.178: OK1.7 R8.1
N$13
  Top 0.178: R14.2 40.98,23.53 39.75,24.77 OK1.9
N$14
  Top 0.178: OK1.11 37.21,23.62 37.47,23.37 40.51,23.37 41.15,22.73 42.63,22.73 R12.2
N$15
  Top 0.178: OK1.13 34.67,23.24 34.92,22.99 40.39,22.99 41.02,22.35 43.78,22.35 R10.2
N$16
  Top 0.178: R15.1 LED3.A
N$17
  Top 0.178: OK1.3 R6.1
N$18
  Top 0.178: R16.1 LED4.A
N$19
  pour Top (no thermals): 11.05,52.07 8.13,52.07 8.13,50.8 12.45,50.8 14.22,49.02 19.18,49.02 19.18,54.61 13.59,54.61
N$20
  Top 0.178: R17.1 LED7.A
N$21  (via drill 0.5)
  Top 0.305: 8.76,58.55 8.8,58.59 R33.2
  Top 0.406: U2.5 3.68,55.24 2.79,56.13 2.79,57.15 3.31,57.67 | 3.31,57.67 v3.81,58.17 4.32,58.67 4.32,58.93 4.95,59.56 8,59.56 8.64,58.93 R34.1 8.68,58.55 8.76,58.55 | R11.2 4.18,56.81 3.31,57.67
  pour Bottom (no thermals): 4.57,55.88 3.05,55.88 3.05,58.42 7.11,58.42 7.11,57.4 4.57,57.4
N$22
  Top 0.178: R21.1 LED8.A
N$23
  Top 0.178: OK1.5 R7.1
N$24
  Top 0.178: U3.1 53.09,47.88 Q1.1
N$25
  Top 0.406: R32.1 R31.1 33.44,69.34 32.51,69.34 31.5,68.33 TH2.2
N$26
  Top 0.178: U3.2 55.75,46.61 54.99,47.37 53.98,47.37 53.59,46.99 53.59,46.35 52.32,45.09 Q1.2
N$27
  Top 0.178: OK3.5 R39.1
N$28
  Bottom 0.406: R24.1 C11.2
N$29  (via drill 0.5)
  Top 0.61: U2.4 10.03,55.24 v10.41,55.63
  Bottom 0.61: v10.41,55.63 10.41,56.9 10.16,57.15 8.89,57.15 8.89,57.06
  pour Bottom (no thermals): 8.13,58.42 8.13,56.13 9.14,56.13 9.14,56.64 9.4,56.9 9.4,57.4 9.14,57.66 9.14,58.42
N$30
  pour Top (no thermals): 17.91,42.42 8.13,42.42 8.13,41.15 9.27,41.15 13.34,36.58 19.18,36.58 19.18,41.15
N$32
  Top 0.178: C19.2 R11.1
N$33
  Top 0.305: C20.2 R1.1
N$34  (via drill 0.35)
  Top 0.178: 76.71,49.78 76.96,49.53 WP.TP
  Top 0.2: v62.74,53.85 61.42,53.85 U4.7 | v76.2,53.34 76.2,50.29 76.71,49.78
  Bottom 0.2: R41.1 60.03,53.85 v62.74,53.85 75.69,53.85 v76.2,53.34
N$35  (via drill 0.35)
  Top 0.178: U4.3 56.69,52.58 v57.91,52.58
  Bottom 0.178: v57.91,52.58 58.17,52.83 R22.1
N$43
  Top 0.178: C25.1 R50.2 R48.2
N$49
  Top 0.178: C29.1 R45.1 R46.1
N$50
  Top 0.178: R68.2 50.65,35.34 U$4.17
N$53
  Top 0.178: OK3.1 R52.1
N$54
  Top 0.178: OK3.15 21.59,21.84 21.97,21.46 39.62,21.46 40.89,20.19 41.62,20.19 R53.2
N$56
  Top 0.178: R73.1 71.59,40.37 P1.L1
N$58  (via drill 0.35)
  Top 0.178: v65.02,51.56 65.13,51.46 66.04,52.38 66.04,52.83 67.46,54.25 U7.1
  Bottom 0.178: R27.1 v65.02,51.56
N$59  (via drill 0.35)
  Top 0.178: v65.02,50.29 66.42,51.69 66.42,52.45 67.59,53.62 U7.2
  Bottom 0.178: R26.1 63.97,50.29 v65.02,50.29
N$60
  Top 0.178: R74.1 P1.L3
N$64
  Top 0.178: IC1.3 37.22,31.23 36.7,31.75 36.7,34.08 R75.1
N$76  (via drill 0.35)
  Top 0.178: v65.02,49.02 65.02,49.28 66.8,51.05 66.8,52.32 67.31,52.83 68.58,52.83 U7.3
  Bottom 0.178: R25.1 64.1,49.02 v65.02,49.02
N$94  (via drill 0.35)
  Top 0.178: v65.02,47.75 65.66,48.39 65.66,49.15 67.18,50.67 67.18,51.94 67.56,52.32 U7.4
  Bottom 0.178: R28.1 64.22,47.75 v65.02,47.75
N$95  (via drill 0.35)
  Top 0.178: v65.02,46.23 66.04,47.24 66.04,48.77 67.56,50.29 67.56,51.31 67.92,51.66 U7.5
  Bottom 0.178: R29.1 64.1,46.23 v65.02,46.23
N$96
  Top 0.406: LED2.A 19.07,3.31 R402.1
N$112  (via drill 0.35)
  Top 0.178: U7.24 73.51,51.66 v73.41,51.56
  Bottom 0.178: v73.41,51.56 73.41,52.32 73.91,52.83 74.51,52.83 R30.1
N$117
  Top 0.178: R20.1 LED6.A
N$237
  Top 0.406: TH1.2 22.86,68.33 23.88,69.34 25.06,69.34 R13.1 R38.1
N$240
  Top 0.406: R40.1 R18.1 16.42,69.34 15.24,69.34 14.22,68.33 TH0.2
OUT0  (via drill 0.3)
  Top 0.178: EXP0.16 33.91,3.85 33.91,8.89 34.29,9.27 34.29,10.03 33.91,10.41 33.91,15.01 v34.29,15.39
  Bottom 0.178: v34.29,15.39 36.55,15.39 37.08,14.86 38,14.86 39.14,13.72 BB1.P8.29
OUT1  (via drill 0.35)
  Top 0.178: EXP0.17 32.83,8.83 v33.53,9.53
  Bottom 0.178: v33.53,9.53 38.48,9.53 BB1.P8.30
OUT2  (via drill 0.3)
  Top 0.178: EXP0.18 32.83,4.89 32,5.71 32,10.16 31.45,10.72 31.45,13.51 v31.27,13.69
  Bottom 0.178: v31.27,13.69 31.45,13.87 31.45,14.22 32.03,14.81 36.5,14.81 BB1.P8.31
RD_N  (via drill 0.3)
  Top 0.178: R45.2 v54.61,37.97 56.39,37.97 56.52,38.1 57.28,38.1 57.4,37.97 58.8,37.97 P1.R8 | U$4.12 48.95,32.11 v49.63,32.11
  Route2 0.178: v49.63,32.11 49.89,32.11 54.61,36.83 v54.61,37.97
RD_P  (via drill 0.3)
  Top 0.178: P1.R7 61.54,37.52 57.4,37.52 v56.9,37.52 56.48,37.52 R46.2 | U$4.11 48.85,31.5 v49.02,31.5
  Route2 0.178: v49.02,31.5 49.91,31.5 55.93,37.52 v56.9,37.52
SPI1_CS0  (via drill 0.3)
  Top 0.178: U$4.26 45.85,37.33 45.85,37.34 44.45,38.73 41.15,38.73 v41.02,38.86
  Bottom 0.178: BB1.P9.28 42.67,58.93 40.77,57.02 40.77,39.12 v41.02,38.86
SPI1_MISO  (via drill 0.3)
  Top 0.178: 45.9,36.52 U$4.27 44.24,38.23 39.88,38.23 v39.75,38.35
  Bottom 0.178: BB1.P9.29 41.17,60.94 41.17,58.95 40.01,57.78 40.01,38.86 39.75,38.61 v39.75,38.35
SPI1_MOSI  (via drill 0.3)
  Top 0.178: v39.37,35.81 39.5,35.69 43.95,35.69 U$4.31
  Bottom 0.178: BB1.P9.30 40.13,58.73 39.62,58.22 39.62,39.12 39.12,38.61 39.12,36.07 v39.37,35.81
SPI1_SCLK  (via drill 0.3)
  Top 0.178: 45.49,36.17 U$4.28 44.04,37.72 39.5,37.72 38.99,38.23 v38.99,39.37
  Bottom 0.178: BB1.P9.31 38.86,60.71 38.86,58.93 39.24,58.55 39.24,39.62 v38.99,39.37
SW_0  (via drill 0.35)
  Top 0.178: U5.2 44.96,49.73 44.96,51.05 44.48,51.54 44.48,57.05 v44.83,57.4
  Bottom 0.178: v44.83,57.4 51.94,57.4 52.32,57.78 58.8,57.78 BB1.P9.14
SW_0_IN  (via drill 0.35)
  Top 0.178: ISW.3 43.94,60.6 43.71,60.38 43.71,56.49 43.18,55.96 v43.18,52.53 | v46.23,51.31 46.23,49.73 U5.3
  Bottom 0.178: v43.18,52.53 43.64,52.07 45.47,52.07 v46.23,51.31 | R62.1 43.94,67.6 ISW.3
SW_1
  Top 0.178: BB1.P9.23 46.71,60.94 46.71,58.42 45.72,57.43 45.72,52.83 47.62,50.93 U5.4
SW_1_IN
  Top 0.178: ISW.4 46.48,63.75 47.22,63.02 48.51,63.02 48.79,62.74 48.79,58.19 48.26,57.66 48.26,51.56 48.77,51.05 48.77,49.73 U5.5
  Bottom 0.178: R63.1 46.48,67.6 ISW.4
SW_2  (via drill 0.35)
  Top 0.178: BB1.P9.15 56.87,60.94 56.87,58.98 56.9,58.95 56.9,58.67 56.13,57.91 55.88,57.91 53.59,55.63 v53.59,51.56 | U5.6 50.16,51.18 v50.29,51.31
  Bottom 0.178: v50.29,51.31 53.34,51.31 v53.59,51.56
SW_2_IN
  Top 0.178: ISW.5 49.02,63.25 49.25,63.02 49.25,58.95 49.53,58.67 49.53,53.34 50.04,52.83 50.8,52.83 51.31,52.32 51.31,49.73 U5.7
  Bottom 0.178: R64.1 49.02,67.6 ISW.5
SW_3  (via drill 0.35)
  Top 0.178: v51.56,58.04 51.56,54.66 U5.10
  Bottom 0.178: BB1.P9.16 56.77,58.29 51.82,58.29 v51.56,58.04
SW_3_IN
  Top 0.178: ISW.6 51.56,62.99 51.33,62.76 51.33,59.28 52.58,58.04 52.58,54.66 U5.9
  Bottom 0.178: R65.1 51.56,67.6 ISW.6
SW_4_IN  (via drill 0.35)
  Top 0.178: ISW.7 54.1,58.04 v53.21,57.15 | v50.29,56.77 50.29,54.66 U5.11
  Bottom 0.178: v53.21,57.15 52.58,57.15 52.2,56.77 v50.29,56.77 | R66.1 54.1,67.6 ISW.7
SW_5_IN  (via drill 0.35)
  Top 0.178: ISW.8 56.46,65.1 56.46,58.98 55.78,58.29 55.37,58.29 v54.23,57.15 | U5.14 46.35,56.01 v46.48,56.13
  Bottom 0.178: v46.48,56.13 52.32,56.13 52.7,56.52 53.59,56.52 v54.23,57.15 | R67.1 56.64,67.6 ISW.8
SW_EXT0
  Top 0.178: BB1.P8.7 68.07,16.51 67.56,17.02 U6.2
SW_EXT0_IN  (via drill 0.3)
  Top 0.178: R51.1 U6.3 60.2,18.29 v60.07,18.16 | R9.2 46.52,18.16 v47.62,18.16
  Bottom 0.178: v47.62,18.16 v60.07,18.16
SW_EXT1
  Top 0.178: BB1.P8.8 69.11,12.22 69.11,19.02 68.58,19.56 U6.4
SW_EXT1_IN  (via drill 0.3)
  Top 0.178: R57.1 U6.5 59.31,20.83 v58.67,21.46 | R10.1 50.63,25.23 51.05,25.65 v55.5,25.65
  Bottom 0.178: v55.5,25.65 55.88,25.27 57.66,25.27 58.04,24.89 58.04,22.1 v58.67,21.46
SW_EXT2
  Top 0.178: BB1.P8.9 66.93,12.32 66.93,10.79 67.69,10.03 68.58,10.03 69.57,11.02 69.57,21.61 69.09,22.1 U6.6
SW_EXT2_IN  (via drill 0.3)
  Top 0.178: R58.1 U6.7 59.05,23.37 v58.67,23.75 | R12.1 44.23,26.04 45.59,26.04 45.97,25.65 50.42,25.65 50.8,26.04 54.86,26.04 55.12,26.29 56.13,26.29 v56.39,26.04
  Bottom 0.178: v56.39,26.04 56.77,25.65 57.91,25.65 58.42,25.15 58.42,24 v58.67,23.75
SW_EXT3
  Top 0.178: BB1.P8.10 64.14,12.57 61.98,12.57 61.59,12.95 61.59,14.22 60.96,14.86 60.02,14.86 58.93,15.95 58.93,17.14 58.42,17.65 58.42,20.83 58.04,21.21 58.04,23.11 57.78,23.37 U6.10
SW_EXT3_IN  (via drill 0.3)
  Top 0.178: U6.9 R59.1 52.79,23.75 46.74,23.75 v46.48,24 | R14.1 42.71,26.04 43.56,26.04 43.94,26.42 46.1,26.42 v46.23,26.29
  Bottom 0.178: v46.23,26.29 46.23,24.26 v46.48,24
SW_EXT4  (via drill 0.3)
  Top 0.178: v58.65,12.22 59.38,12.95 59.38,14.78 58.42,15.75 58.42,17.02 58.04,17.4 58.04,20.57 57.78,20.83 U6.12
  Bottom 0.178: v58.65,12.22 46.25,12.22 BB1.P8.26
SW_EXT4_IN
  Top 0.178: R53.1 42.71,19.05 48.9,19.05 50.93,21.08 52.67,21.08 R60.1 U6.11
SW_EXT5  (via drill 0.35)
  Top 0.178: v58.17,15.11 58.17,15.37 58.04,15.49 58.04,16.76 57.78,17.02 U6.15
  Bottom 0.178: BB1.P8.27 43.81,14.86 57.91,14.86 v58.17,15.11
SW_EXT5_IN  (via drill 0.3)
  Top 0.178: R23.1 44.23,17.4 45.21,17.4 45.59,17.02 47.93,17.02 v48.13,16.82 | U6.14 R42.1 53.59,18.2 v53.59,17.27
  Bottom 0.178: v48.13,16.82 48.13,17.14 48.77,17.78 53.09,17.78 v53.59,17.27
SW_EXT6_IN  (via drill 0.3)
  Top 0.178: R36.1 45.76,17.4 48.51,17.4 49.02,16.89 49.02,13.08 v48.9,12.95
  Bottom 0.178: BB1.P8.28 44.17,12.68 48.62,12.68 v48.9,12.95
SYS_5V
  pour Route15 (no thermals): 38.1,66.67 38.1,64.14 66.8,64.14 66.8,58.42 69.34,58.42 69.34,64.64 67.31,66.67
TD_N
  Top 0.178: P1.R2 59.31,30.76 58.5,29.95 56.29,29.95 56.01,30.23 R48.1 56.01,31.24 55.5,31.75 51.44,31.75 U$4.15
TD_P
  Top 0.178: P1.R1 58.5,29.59 54.99,29.59 54.61,29.97 | R50.1 54.61,29.97 | 54.61,29.97 52.07,29.97 51.44,30.61 51.44,31.24 49.91,32.77 49.7,32.77 U$4.14
TERM_EXT_0
  Top 0.406: R40.2 C46.1 19.05,65.37 19.05,64.01 19.81,63.25 26.16,63.25 BB1.P9.39
TERM_EXT_1
  Top 0.406: C26.1 R38.2 | C26.1 26.67,66.29 | BB1.P9.40 28.7,60.71 28.7,62.48 27.69,63.5 27.69,65.53 26.84,66.38 C26.1
TERM_EXT_2
  Top 0.406: R32.2 C7.1 32.77,64.1 32.77,63.75 32.26,63.25 31.5,63.25 30.23,61.98 BB1.P9.37
UART4_RXD  (via drill 0.3, 0.35)
  Top 0.178: v38.63,45.41 39.19,45.97 41.02,45.97 41.22,45.77 41.99,45.77 v42.19,45.97 | v58.17,45.97 59.05,46.86 59.05,56.77 59.61,57.33 61.47,57.33 61.92,57.78 61.92,61.16 62.74,61.98 BB1.P9.11 | EXP0.11 38.83,8.44 39.05,8.44 41.17,10.57 41.17,14.58 40.77,14.99 40.77,15.37 v40.64,15.49
  Bottom 0.178: v38.63,45.41 38.35,45.14 38.35,16.64 39.75,15.24 40.39,15.24 v40.64,15.49 | v42.19,45.97 53.59,45.97 53.85,45.72 54.61,45.72 54.86,45.97 v58.17,45.97
UART4_TXD  (via drill 0.3, 0.35)
  Top 0.178: EXP0.12 39.88,3.98 39.88,8.64 41.63,10.39 41.63,15.01 v41.53,15.11 | BB1.P9.13 60.71,61.98 61.52,61.16 61.52,57.96 61.24,57.68 59.38,57.68 58.67,56.97 58.67,47.37 v58.42,47.12 | v41.48,46.35 38.61,46.35 v38.56,46.3
  Bottom 0.178: v58.42,47.12 57.66,46.35 54.74,46.35 54.48,46.1 53.98,46.1 53.72,46.35 42.65,46.35 42.44,46.56 41.68,46.56 v41.48,46.35 | v38.56,46.3 37.97,45.72 37.97,16.51 39.62,14.86 41.27,14.86 v41.53,15.11
UART5_RXD  (via drill 0.35)
  Top 0.178: EXP0.9 40.83,8.45 40.83,8.7 v41.48,9.35
  Bottom 0.178: BB1.P8.38 31.01,12.22 40.95,12.22 41.17,11.99 41.17,10.01 41.48,9.7 v41.48,9.35
UART5_TXD  (via drill 0.35)
  Top 0.178: v42.29,9.78 42.29,9.14 41.91,8.76 41.91,3.81 41.03,2.93
  Top 0.305: 41.03,2.93 EXP0.10
  Bottom 0.178: BB1.P8.37 31.01,12.68 41.2,12.68 41.63,12.24 41.63,10.44 v42.29,9.78
VBAT
  pour Route15 (rank 2): 82.04,51.82 82.04,72.39 68.07,72.39 68.07,66.55 73.91,66.55 76.96,63.5 76.96,51.82
VBAT+  (via drill 0.35)
  Top 0.406: v54.86,44.83 55.37,45.34 U3.3
  Route15 0.406: v36.07,44.45 54.48,44.45 v54.86,44.83
  Bottom 0.406: B1.+2 4.45,26.29 3.05,27.69 3.05,40.64 4.57,42.16 B1.+1 12.95,42.16 13.34,42.55 34.16,42.55 v36.07,44.45
VDD18CORE
  Top 0.178: U$4.5 45.09,31.9 45.09,31.88 44.45,31.24 44.45,30.73 44.71,30.48 C23.+ 44.99,29.62 FB1.1
VDD18PLL  (via drill 0.3)
  Top 0.178: C32.1 45.85,40.26 v48.39,37.72 48.39,37.34 U$4.23 | FB1.2 49.32,29.62 49.32,29.68 v48.77,30.23 48.01,30.99 47.94,30.99 U$4.9 | FB1.2 49.91,29.57 C28.+ | FB1.2 50.4,29.08 C33.1
  Route15 0.178: v48.77,30.23 48.39,30.61 48.39,33.02 49.02,33.66 49.02,34.92 48.39,35.56 v48.39,37.72
VDD_ADC  (via drill 0.35)
  Top 0.406: R18.2 v16.51,66.04 | R13.2 v25.15,66.04 | R31.2 v33.53,66.04
  Bottom 0.406: v16.51,66.04 17.78,66.04 19.05,67.31 23.88,67.31 v25.15,66.04 26.42,66.04 27.69,67.31 32.26,67.31 v33.53,66.04 35.56,66.04 36.32,65.28 36.32,60.71 BB1.P9.32
VDD_IN  (via drill 0.35, 0.6)
  Top 0.406: R402.2 R401.1 v17.78,8.38 | v10.41,54.1 10.29,53.98 U2.3 | v10.41,44.45 10.29,44.32 U1.3 | D1.C 13.29,20.41 24V.TP
  Top 0.61: v2.03,51.56 2.16,51.44 U2.8 | v2.03,41.4 2.41,41.78 U1.8
  Top 0.813: 12.7,18.97 FU1.3 | FU1.4 12.7,18.97 | 12.7,18.97 D1.C
  Route15 0.406: v17.78,8.38 10.92,15.24 11,15.32 FU1.4
  Bottom 0.406: 2.03,42.93 1.9,42.93 C4.1
  Bottom 0.61: C14.1 3.81,53.34 v2.03,51.56 | 2.03,42.93 v2.03,41.4
  other vias: 8.13,37.59 6.1,37.59
  pour Route15 (isolate 0.254, rank 4): 8.89,15.24 16.51,15.24 16.51,24.38 10.67,30.23 10.67,55.88 0,55.88 0,41.91 3.81,38.1 3.81,28.45 8.89,23.37
  pour Top (no thermals): 5.33,36.83 8.89,36.83 8.89,38.35 7.87,39.37 7.87,40.39 6.35,40.39 6.35,39.37 5.33,38.35
  pour Bottom: 8.89,14.99 8.89,18.29 10.16,19.56 15.24,19.56 16.51,18.29 16.51,14.99 15.24,13.72 10.16,13.72
VIN  (via drill 0.35)
  Top 0.406: v17.78,4.06 LED1.A
  Top 1.422: FU1.1 FU1.2
  Route15 0.406: v17.78,4.06 16.38,5.46
  pour Route15 (isolate 0.254, rank 3): 4.32,19.3 8.64,19.3 8.64,16.51 16.51,8.64 16.51,4.57 8.89,4.57 8.89,9.14 4.32,13.72
X1
  Top 0.178: C42.1 47.32,40.5 X1.1 48.48,38.64 49.78,37.34 49.78,36.6 U$4.20
X2  (via drill 0.3)
  Top 0.178: C43.1 51.49,42.05 X1.3 49.4,41.12 v49.4,39.24 | v49.15,37.08 49.15,36.68 U$4.21
  Bottom 0.178: v49.4,39.24 49.4,37.34 v49.15,37.08

## Text on the board
Top: 1
Route2: 2
Route15: 3
Bottom: 4
tPlace: ArmazCape / Rev B4 | GND | +24V | DV_EN
Document: ExMachina / Released under / Creatives Commons / CC BY-NC-SA | www.exmachina.fr
tDocu: Top side
bDocu: Bottom side